# EAGLE schematic Schema serre (EAGLE 9.6.2)
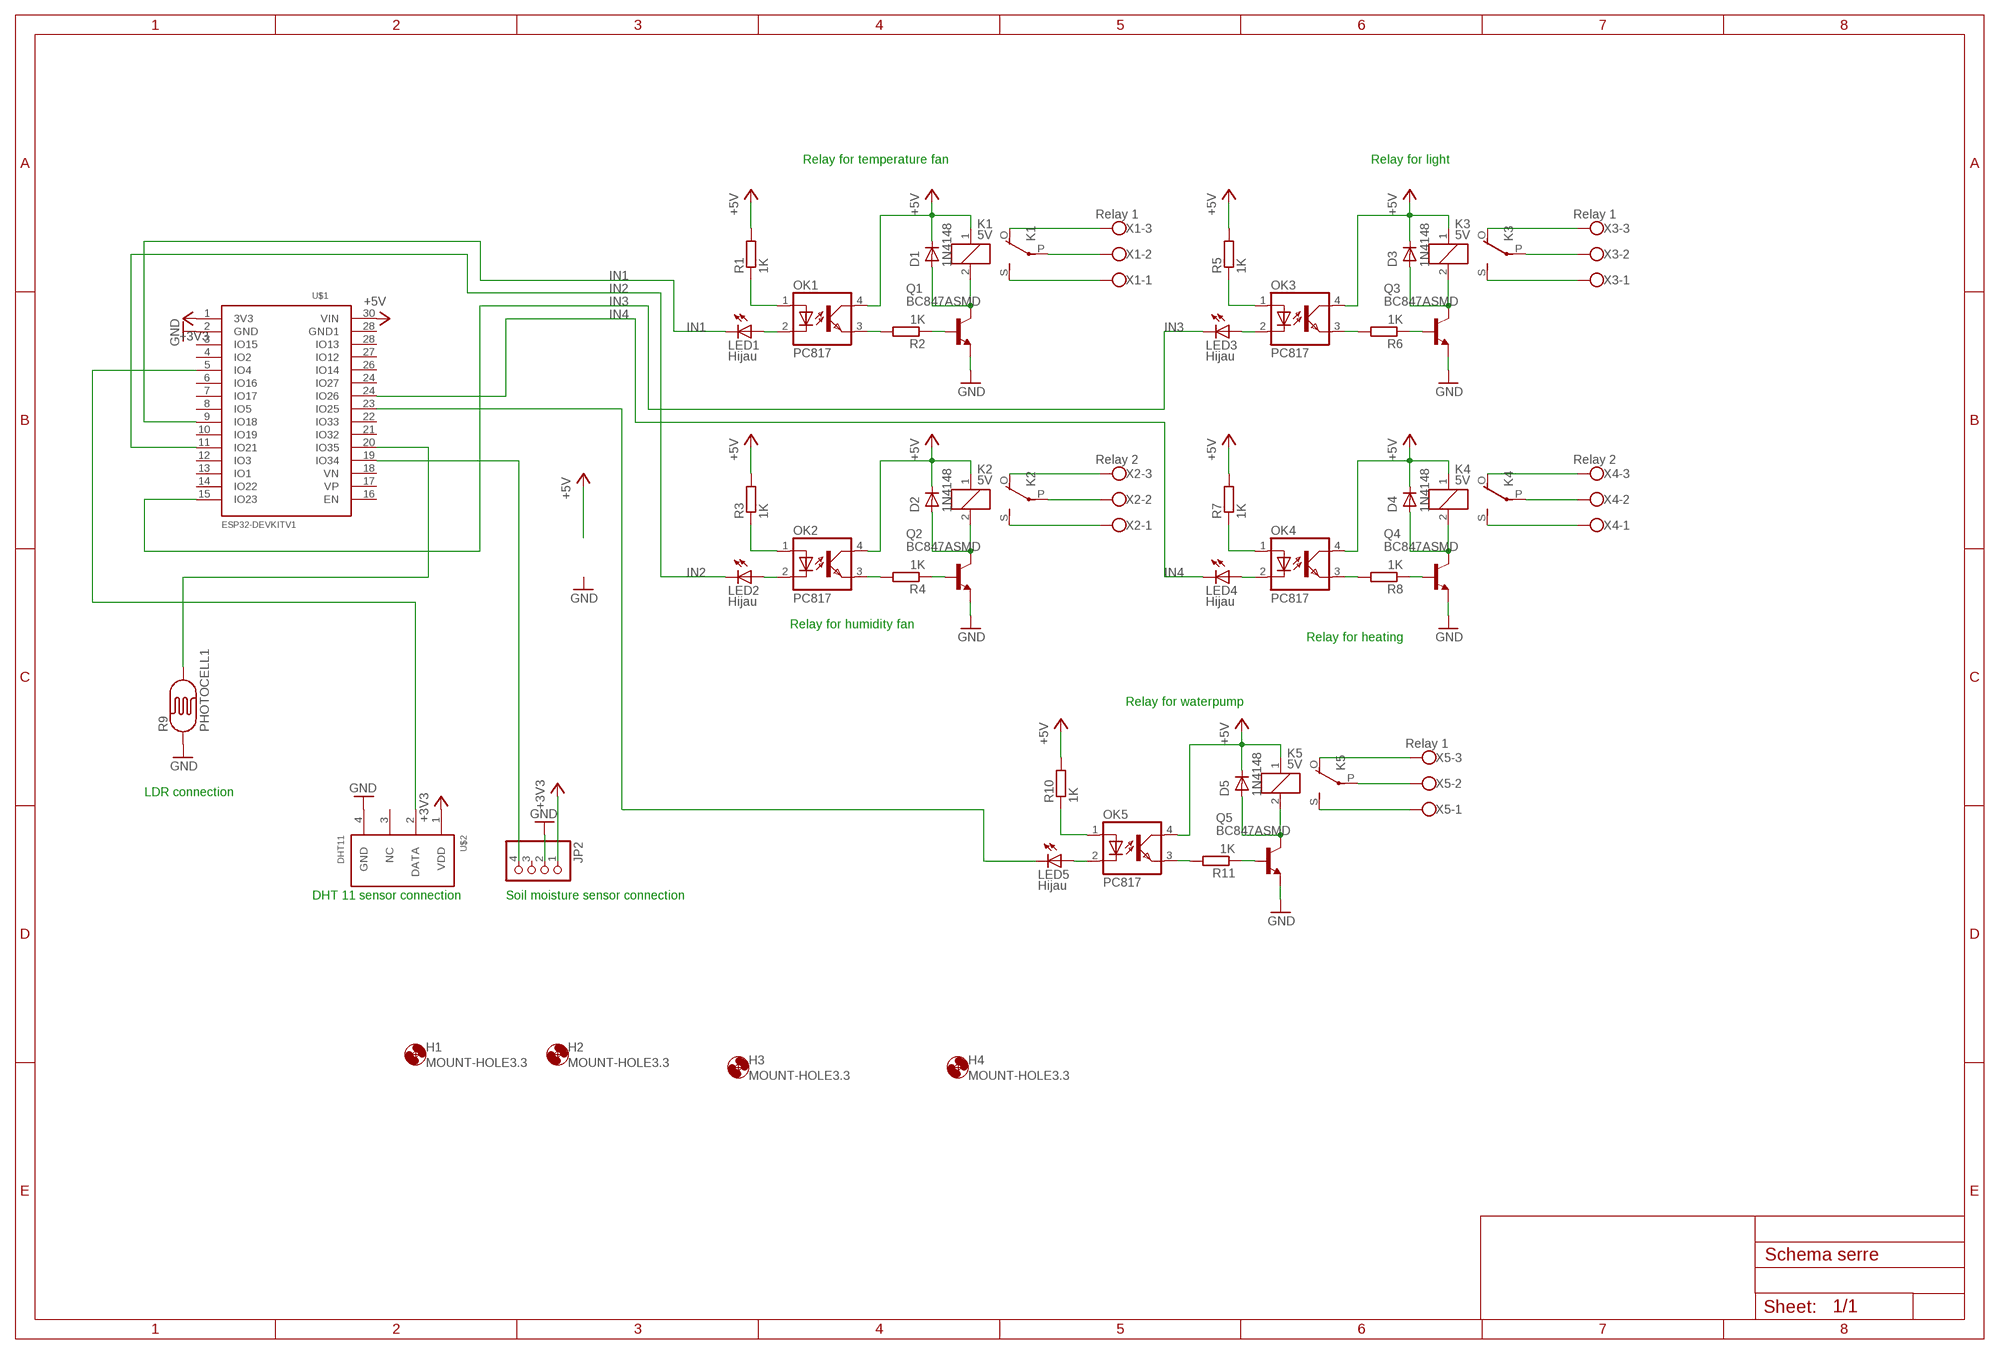
[diagram p0: schematic, sheet 1]

## Parts
D1  1N4148  GF1  [SMA-DO214AC]
D2  1N4148  GF1  [SMA-DO214AC]
D3  1N4148  GF1  [SMA-DO214AC]
D4  1N4148  GF1  [SMA-DO214AC]
D5  1N4148  GF1  [SMA-DO214AC]
H1  MOUNT-HOLE3.3  [3,3]
H2  MOUNT-HOLE3.3  [3,3]
H3  MOUNT-HOLE3.3  [3,3]
H4  MOUNT-HOLE3.3  [3,3]
JP2  PINHD-1X4  [1X04]
K1  5V  ZF112  [ZF112]
K2  5V  ZF112  [ZF112]
K3  5V  ZF112  [ZF112]
K4  5V  ZF112  [ZF112]
K5  5V  ZF112  [ZF112]
LED1  Hijau  LED3MM  [LED3MM]
LED2  Hijau  LED3MM  [LED3MM]
LED3  Hijau  LED3MM  [LED3MM]
LED4  Hijau  LED3MM  [LED3MM]
LED5  Hijau  LED3MM  [LED3MM]
OK1  PC817  [DIL04]
OK2  PC817  [DIL04]
OK3  PC817  [DIL04]
OK4  PC817  [DIL04]
OK5  PC817  [DIL04]
Q1  BC847ASMD  [SOT23]
Q2  BC847ASMD  [SOT23]
Q3  BC847ASMD  [SOT23]
Q4  BC847ASMD  [SOT23]
Q5  BC847ASMD  [SOT23]
R1  1K  R-EU_R1206  [R1206]
R2  1K  R-EU_R1206  [R1206]
R3  1K  R-EU_R1206  [R1206]
R4  1K  R-EU_R1206  [R1206]
R5  1K  R-EU_R1206  [R1206]
R6  1K  R-EU_R1206  [R1206]
R7  1K  R-EU_R1206  [R1206]
R8  1K  R-EU_R1206  [R1206]
R9  PHOTOCELL1  [LDR_OFFBOARD]
R10  1K  R-EU_R1206  [R1206]
R11  1K  R-EU_R1206  [R1206]
U$1  ESP32DEVKITV1  [ESP32-DEVKITV1]
U$2  DHT11  [DHT11]
X1  Relay 1  W237-103  [W237-103]
X2  Relay 2  W237-103  [W237-103]
X3  Relay 1  W237-103  [W237-103]
X4  Relay 2  W237-103  [W237-103]
X5  Relay 1  W237-103  [W237-103]

## Nets
+3V3: JP2.1 U$1.1(3V3) U$2.1(VDD)
+5V: D1.K(C) D2.K(C) D3.K(C) D4.K(C) D5.K(C) K1.1 K2.1 K3.1 K4.1 K5.1 OK1.4(COL) OK2.4(COL) OK3.4(COL) OK4.4(COL) OK5.4(COL) R1.2 R3.2 R5.2 R7.2 R10.2 U$1.30(VIN)
GND: JP2.2 Q1.2(E) Q2.2(E) Q3.2(E) Q4.2(E) Q5.2(E) R9.1 U$1.2(GND) U$2.4(GND)
IN1: LED1.K(C) LED5.K(C) U$1.9(IO18) U$1.23(IO25)
IN2: LED2.K(C) U$1.11(IO21)
IN3: LED3.K(C) U$1.15(IO23)
IN4: LED4.K(C) U$1.24(IO26)
N$1: LED1.A OK1.2(C)
N$2: K1.O(2:O) X1.3
N$3: K1.P(2:P) X1.2
N$4: K1.S(2:S) X1.1
N$5: OK1.1(A) R1.1
N$6: LED3.A OK3.2(C)
N$7: OK1.3(EMIT) R2.2
N$8: D1.A K1.2 Q1.3(C)
N$9: Q1.1(B) R2.1
N$10: LED2.A OK2.2(C)
N$11: K2.O(2:O) X2.3
N$12: K2.P(2:P) X2.2
N$13: K2.S(2:S) X2.1
N$14: OK2.1(A) R3.1
N$15: K3.O(2:O) X3.3
N$16: OK2.3(EMIT) R4.2
N$17: D2.A K2.2 Q2.3(C)
N$18: Q2.1(B) R4.1
N$19: K3.P(2:P) X3.2
N$20: K3.S(2:S) X3.1
N$21: OK3.1(A) R5.1
N$22: OK3.3(EMIT) R6.2
N$23: D3.A K3.2 Q3.3(C)
N$24: Q3.1(B) R6.1
N$25: LED4.A OK4.2(C)
N$26: K4.O(2:O) X4.3
N$27: K4.P(2:P) X4.2
N$28: K4.S(2:S) X4.1
N$29: OK4.1(A) R7.1
N$30: OK4.3(EMIT) R8.2
N$31: D4.A K4.2 Q4.3(C)
N$32: Q4.1(B) R8.1
N$33: U$1.5(IO4) U$2.2(DATA)
N$34: R9.2 U$1.20(IO35)
N$35: JP2.4 U$1.19(IO34)
N$36: LED5.A OK5.2(C)
N$37: K5.O(2:O) X5.3
N$38: K5.P(2:P) X5.2
N$39: K5.S(2:S) X5.1
N$40: OK5.1(A) R10.1
N$41: OK5.3(EMIT) R11.2
N$42: D5.A K5.2 Q5.3(C)
N$43: Q5.1(B) R11.1
Unconnected: JP2.3 U$1.3(IO15) U$1.4(IO2) U$1.6(IO16) U$1.7(IO17) U$1.8(IO5) U$1.10(IO19) U$1.12(IO3) U$1.13(IO1) U$1.14(IO22) U$1.16(EN) U$1.17(VP) U$1.18(VN) U$1.21(IO32) U$1.22(IO33) U$1.24(IO27) U$1.26(IO14) U$1.27(IO12) U$1.28(GND1) U$1.28(IO13) U$2.3(NC)

## Notes on the sheet
- Relay for temperature fan | Relay for light
- Relay for humidity fan
- Relay for heating
- Relay for waterpump
- LDR connection
- DHT 11 sensor connection | Soil moisture sensor connection

## Library data of the parts
D1-D5 = diode:GF1: DIODE
H1-H4 = holes:MOUNT-HOLE: MOUNTING HOLE with drill center marker
JP2 = pinhead:PINHD-1X4: PIN HEADER
K1-K5 = relay:ZF112: RELAY 1 x switch; OC_FARNELL: unknown; OC_NEWARK: unknown
LED1-LED5 = led:LED: LED OSRAM: - CHIPLED LG R971, LG N971, LY N971, LG Q971, LY Q971, LO R971, LY R971 LH N974, LH R974 LS Q976, LO Q976, LY Q976 LO Q996 - Hyper CHIPLED LW Q18S LB Q993, LB Q99A, LB R99A - SideLED LS A670, LO A670, LY A670, LG A670, LP A670 LB A673, LV A673, LT A673, LW A673 LH A674 LY A675 LS A676, LA A676, LO A676, LY A676, LW A676 LS A679, LY A679, LG A679 - Hyper Micro SIDELED® LS Y876, LA Y876, LO Y876, LY Y876 LT Y87S - SmartLED LW L88C, LW L88S LB L89C, LB L89S, LG L890 LS L89K, LO L89K, LY L89K LS L896, LA L896, LO L896, LY L896 - TOPLED LS T670, LO T670, LY T670, LG T670, LP T670 LSG T670, LSP T670, LSY T670, LOP T670, LYG T670 LG T671, LOG T671, LSG T671 LB T673, LV T673, LT T673, LW T673 LH T674 LS T676, LA T676, LO T676, LY T676, LB T676, LH T676, LSB T676, LW T676 LB T67C, LV T67C, LT T67C, LS T67K, LO T67K, LY T67K, LW E67C LS E67B, LA E67B, LO E67B, LY E67B, LB E67C, LV E67C, LT E67C LW T67C LS T679, LY T679, LG T679 LS T770, LO T770, LY T770, LG T770, LP T770 LB T773, LV T773, LT T773, LW T773 LH T774 LS E675, LA E675, LY E675, LS T675 LS T776, LA T776, LO T776, LY T776, LB T776 LHGB T686 LT T68C, LB T68C - Hyper Mini TOPLED® LB M676 - Mini TOPLED Santana® LG M470 LS M47K, LO M47K, LY M47K Source: http://www.osram.convergy.de LUXEON: - LUMILED® LXK2-PW12-R00, LXK2-PW12-S00, LXK2-PW14-U00, LXK2-PW14-V00 LXK2-PM12-R00, LXK2-PM12-S00, LXK2-PM14-U00 LXK2-PE12-Q00, LXK2-PE12-R00, LXK2-PE12-S00, LXK2-PE14-T00, LXK2-PE14-U00 LXK2-PB12-K00, LXK2-PB12-L00, LXK2-PB12-M00, LXK2-PB14-N00, LXK2-PB14-P00, LXK2-PB14-Q00 LXK2-PR12-L00, LXK2-PR12-M00, LXK2-PR14-Q00, LXK2-PR14-R00 LXK2-PD12-Q00, LXK2-PD12-R00, LXK2-PD12-S00 LXK2-PH12-R00, LXK2-PH12-S00 LXK2-PL12-P00, LXK2-PL12-Q00, LXK2-PL12-R00 Source: www.luxeon.com KINGBRIGHT: KA-3528ASYC Source: www.kingbright.com
OK1-OK5 = optocoupler:PC817: SHARP OPTO COUPLER; MPN: PC817X4J000F; OC_FARNELL: 9707727; OC_NEWARK: 97K7059
Q1-Q5 = transistor-npn:BC847*: NPN Transistor
R1-R8 R10 R11 = rcl:R-EU_: RESISTOR, European symbol
R9 = LDR:PHOTOCELL: Photo Resitor
U$1 = ESP32-DEVKITV1:ESP32DEVKITV1
U$2 = dht:DHT11
X1-X5 = con-wago-500:W237-103: WAGO SCREW CLAMP; MPN: 237-103; OC_FARNELL: unknown; OC_NEWARK: 18M7116